# EasyEDA schematic SCH_Sensor circuit design_2023-04-27.json
TITLE: Sensor Board; REV: 1.0; Date: 2022-11-28; Sheet: 1/1; Drawn By: Jamie Warnock; Company: MEng Group Project
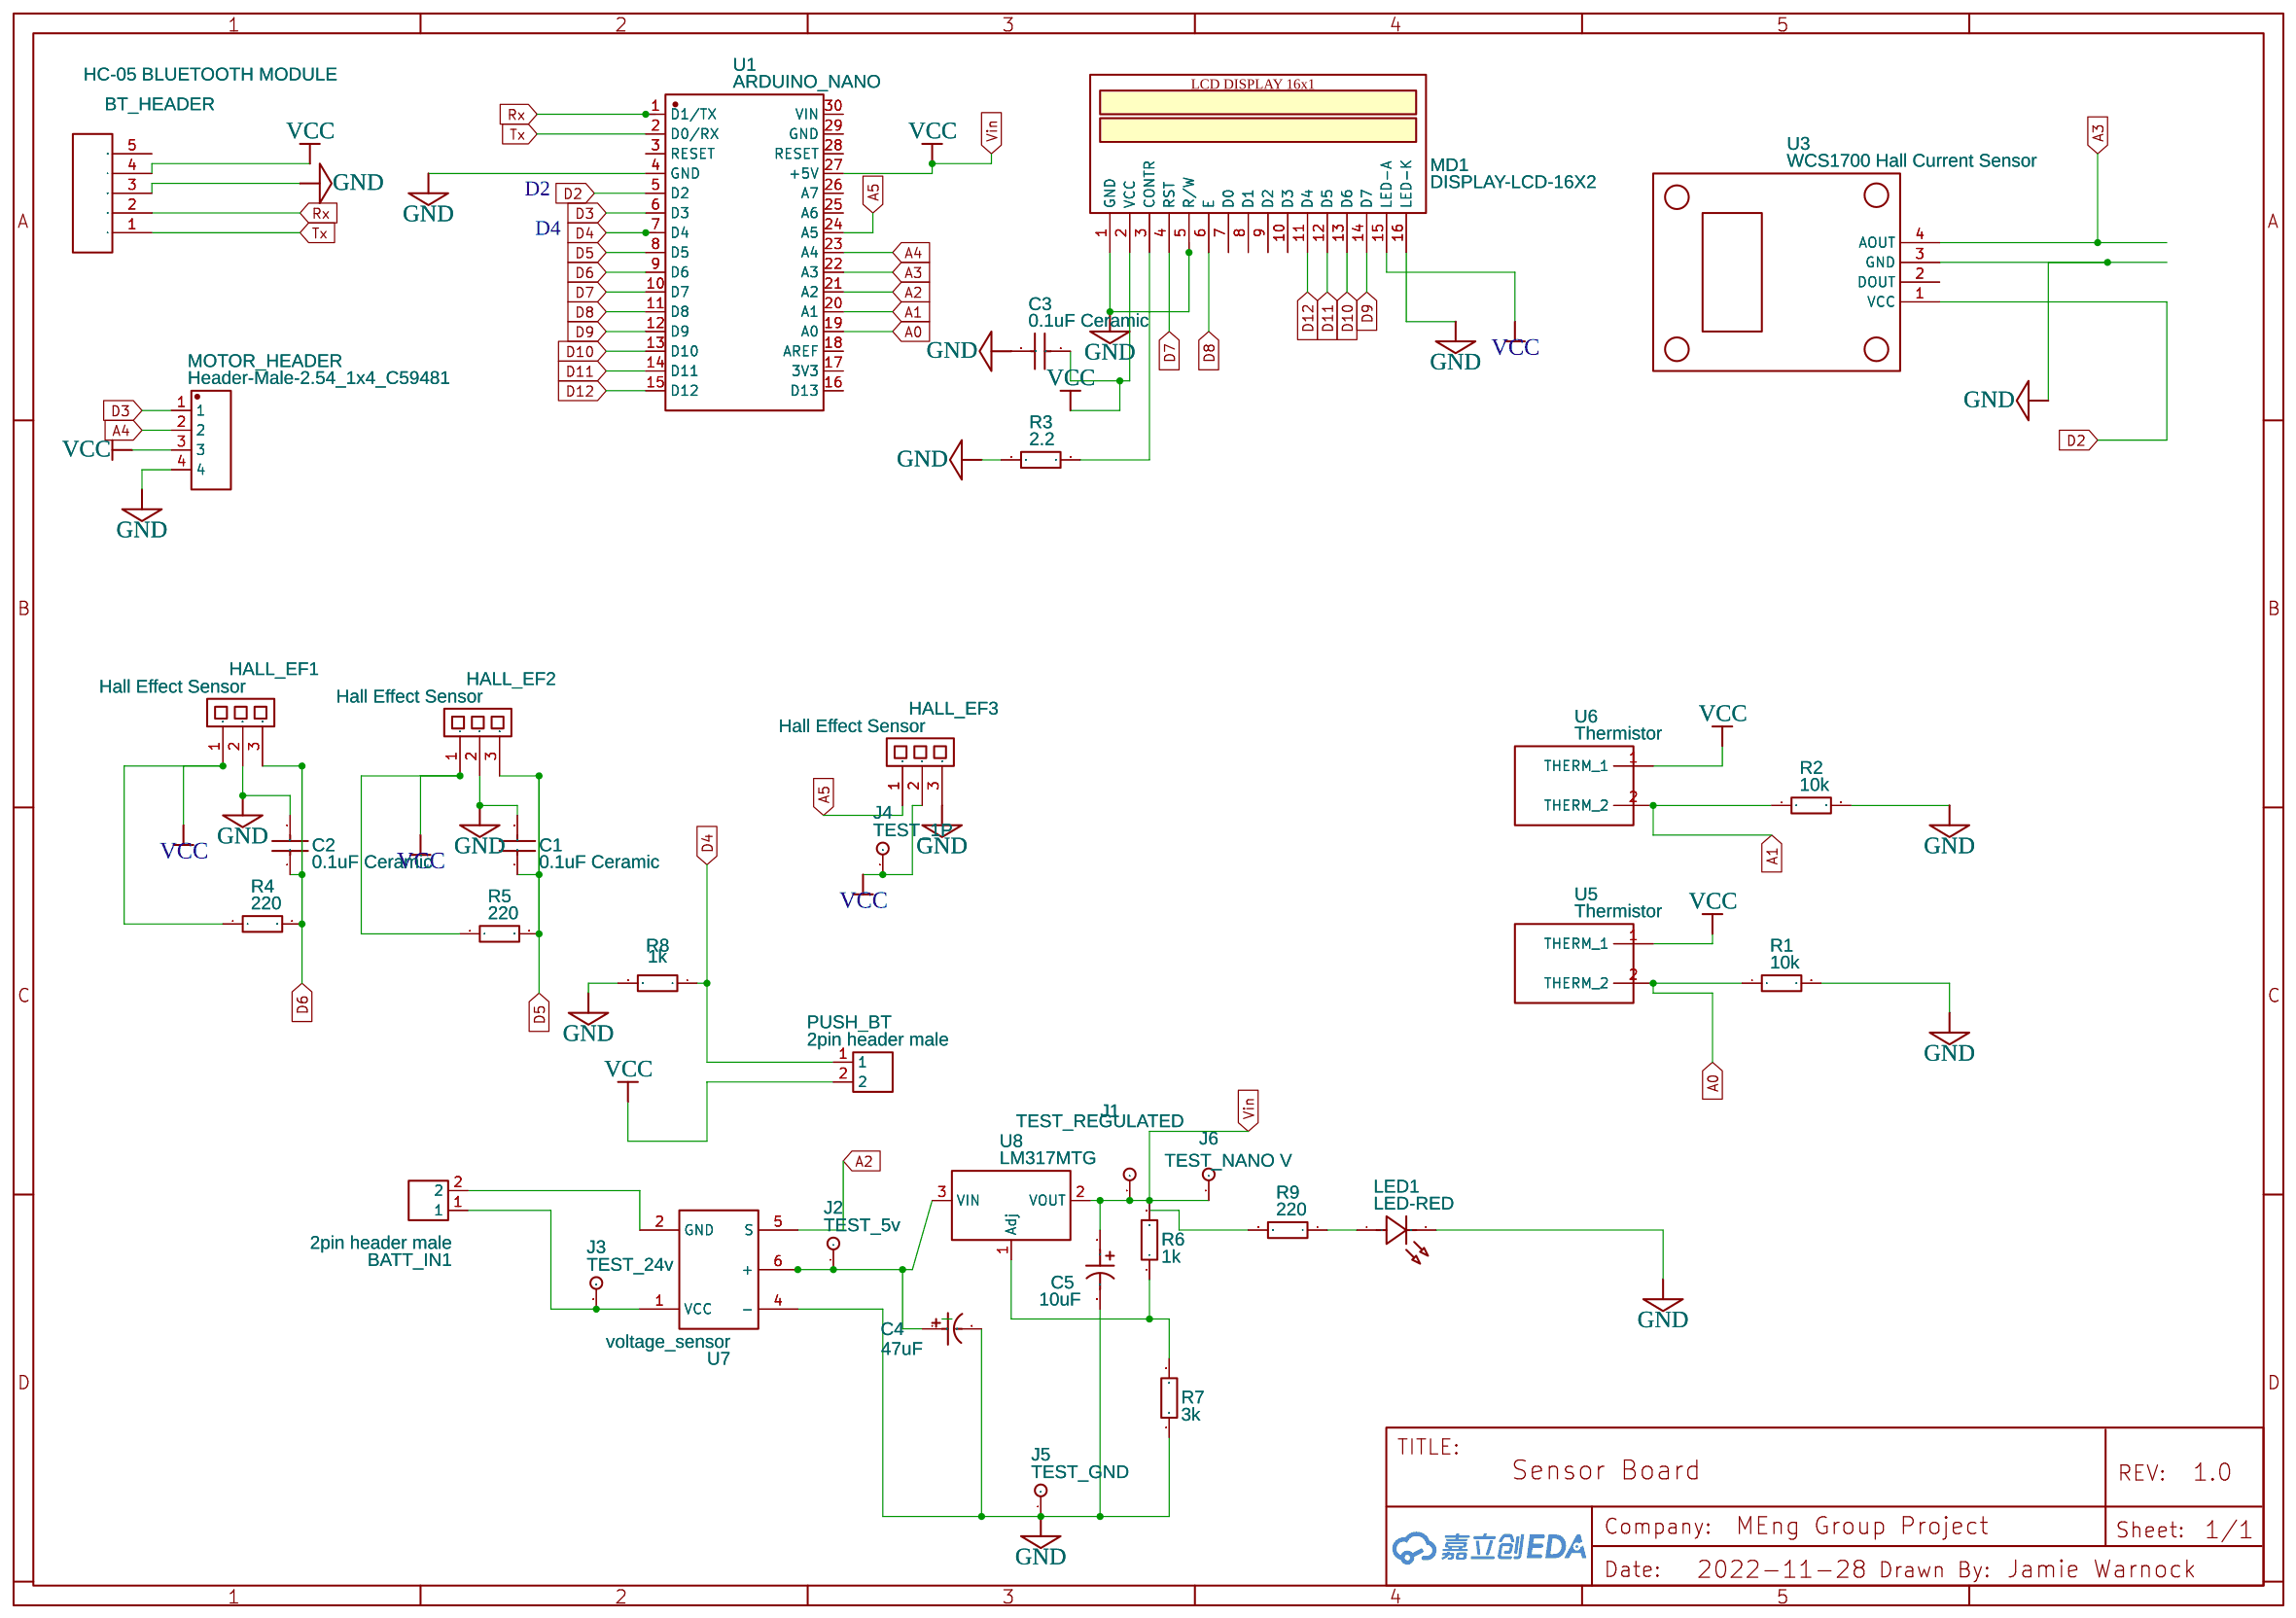
[diagram p0: schematic sheet]

## Parts
BATT_IN1  2pin header male  [CONN-TH_KF35R-8.25-2P]
BT_HEADER  HC-05 BLUETOOTH MODULE  [PIN_HEADER_FEMALE_5 PIN]
C1  0.1uF Ceramic  [CERAMIC CAPACITOR]
C2  0.1uF Ceramic  [CERAMIC CAPACITOR]
C3  0.1uF Ceramic  [CERAMIC CAPACITOR]
C4  47uF  [V 47UF 100V]
C5  10uF  [CAP-TH_BD5.0-P2.00-D0.5-FD-1]
HALL_EF1  Hall Effect Sensor  [HEADER MALE OR FEMALE PINS 1X3]
HALL_EF2  Hall Effect Sensor  [HEADER MALE OR FEMALE PINS 1X3]
HALL_EF3  Hall Effect Sensor  [HEADER MALE OR FEMALE PINS 1X3]
J1  TEST_REGULATED  [TESTPOINT-SMD_BD5.0]
J2  TEST_5v  [TESTPOINT-SMD_BD5.0]
J3  TEST_24v  [TESTPOINT-SMD_BD5.0]
J4  TEST_1P  [TESTPOINT-SMD_BD5.0]
J5  TEST_GND  [TESTPOINT-SMD_BD5.0]
J6  TEST_NANO V  [TESTPOINT-SMD_BD5.0]
LED1  LED-RED  [LED]
MD1  DISPLAY-LCD-16X2  [DISPLAY-LCD-16X2]
MOTOR_HEADER  Header-Male-2.54_1x4_C59481  [HDR-TH_4P-P2.54-V-M]
PUSH_BT  2pin header male  [2PIN MALE HEADER]
R1  10k  [RES-TH_BD5.5-L15.0-P19.00-D0.8]
R2  10k  [RES-TH_BD5.5-L15.0-P19.00-D0.8]
R3  2.2  [RES-TH_BD5.5-L15.0-P19.00-D0.8]
R4  220  [RES-TH_BD5.5-L15.0-P19.00-D0.8]
R5  220  [RES-TH_BD5.5-L15.0-P19.00-D0.8]
R6  1k  [RES-TH_BD5.5-L15.0-P19.00-D0.8]
R7  3k  [RES-TH_BD5.5-L15.0-P19.00-D0.8]
R8  1k  [RES-TH_BD5.5-L15.0-P19.00-D0.8]
R9  220  [RES-TH_BD5.5-L15.0-P19.00-D0.8]
U1  ARDUINO_NANO  [COMM-TH_ARDUINO_NANO]
U3  WCS1700 Hall Current Sensor  [SENSOR CORRIENTE DC 5VDC]
U5  Thermistor  [THERMISTOR-PCB]
U6  Thermistor  [THERMISTOR-PCB]
U7  voltage_sensor  [NMH2405SC]
U8  LM317MTG  [TO-220-3_L10.0-W4.5-P2.54-L]

## Library data of the parts
BATT_IN1 PUSH_BT = 2pin header male: Supplier: LCSC; Manufacturer Part: Headers  Pins2.54mm1*10P; Supplier Part: C57369; JLCPCB Part Class: Extended Part; Contributor: Omkar Pattanaik
BT_HEADER = Female pin header 5 3D: Manufacturer Part: New SchematicLib; Contributor: Sergei Gurinovits
C1-C3 = Capacitor_Ceramic: Contributor: jr_pilot
C4 = v 47uF 100V: Supplier: LCSC; Manufacturer: ValuePro; Manufacturer Part: 47uF 100V; Supplier Part: C36473; JLCPCB Part Class: Extended Part; Contributor: Vijith ECE
C5 = 50V10UF CD110_C2960373: Supplier: LCSC; Supplier Part: C2960373; Manufacturer: HRK(鸿瑞凯电子); Manufacturer Part: 50V10uF CD110; Contributor: lcsc
HALL_EF1-HALL_EF3 = HEADER MALE 1X3: Contributor: dardito2
J1-J6 = TEST_1P: Contributor: KiCAD; license: https://www.gnu.org/licenses/lgpl-2.1.html
LED1 = LED-RED: Supplier: LCSC; Supplier Part: C605466; Manufacturer: Everlight Elec; Manufacturer Part: 264-7ID; Contributor: JohnOniudra; JLCPCB Part Class: Extended Part
MD1 = DISPLAY-LCD-16X2: Contributor: edsonemboaba
MOTOR_HEADER = Header-Male-2.54_1x4_C59481: Supplier: LCSC; Manufacturer: ReliaPro; Manufacturer Part: Headers  Pins 1*4P; Supplier Part: C59481
R1 R2 R4-R9 = EWWR0003J15R0T9: Supplier: LCSC; Supplier Part: C348853; Manufacturer: ResistorToday; Contributor: LCSC; JLCPCB Part Class: Extended Part; Resistance: 15Ω
R3 = EWWR0003J2R20T9: Supplier: LCSC; Supplier Part: C348866; Manufacturer: ResistorToday; Contributor: LCSC; JLCPCB Part Class: Extended Part; Resistance: 2.2Ω
U1 = ARDUINO_NANO: Supplier: LCSC; Supplier Part: C9900017879; Manufacturer: null; JLCPCB Part Class: Extended Part; Contributor: lcsc
U3 = WCS1700 Hall Current Sensor: Manufacturer: AOWEZIIC; Supplier Part: WCS1700; Contributor: The shadow of me
U5 U6 = Thermistor: Contributor: xstaticgrey
U7 = voltage_sensor: Manufacturer: Murata Manufacturing Co., Ltd.; Manufacturer Part: NMH1212SC; Supplier Part: 811-1518-5-ND; Contributor: mimk0404120
U8 = LM317MTG: Supplier: LCSC; Supplier Part: C907009; Manufacturer: onsemi(安森美); Contributor: LCSC; JLCPCB Part Class: Extended Part

## Nets
GND: BT_HEADER.3 C1.2 C2.2 C3.1 C4.2 C5.2 HALL_EF1.2 HALL_EF2.2 HALL_EF3.3 J5.1 LED1.2(K) MD1.1(GND) MD1.5(R/W) MD1.16(LED-K) MOTOR_HEADER.4 R1.2 R2.2 R3.1 R7.1 R8.2 U1.4(GND) U3.3(GND) U7.4(-)
VCC: BT_HEADER.4 C3.2 C5.1 HALL_EF1.1 HALL_EF2.1 HALL_EF3.2 J1.1 J4.1 J6.1 MD1.2(VCC) MD1.15(LED-A) MOTOR_HEADER.3 PUSH_BT.2 R4.1 R5.1 R6.2 R9.2 U1.27(+5V) U5.1(THERM 1) U6.1(THERM 1) U8.2(VOUT)
A0: R1.1 U1.19(A0) U5.2(THERM 2)
A1: R2.1 U1.20(A1) U6.2(THERM 2)
A2: U1.21(A2) U7.5(S)
A3: U1.22(A3) U3.4(AOUT)
A4: MOTOR_HEADER.2 U1.23(A4)
A5: HALL_EF3.1 U1.24(A5)
D2: U1.5(D2) U3.1(VCC)
D3: MOTOR_HEADER.1 U1.6(D3)
D4: PUSH_BT.1 R8.1 U1.7(D4)
D5: C1.1 HALL_EF2.3 R5.2 U1.8(D5)
D6: C2.1 HALL_EF1.3 R4.2 U1.9(D6)
D7: MD1.4(RST) U1.10(D7)
D8: MD1.6(E) U1.11(D8)
D9: MD1.14(D7) U1.12(D9)
D10: MD1.13(D6) U1.13(D10)
D11: MD1.12(D5) U1.14(D11)
D12: MD1.11(D4) U1.15(D12)
Rx: BT_HEADER.2 U1.1(D1/TX)
Tx: BT_HEADER.1 U1.2(D0/RX)
Net-(BATT_IN1-1): BATT_IN1.1 J3.1 U7.1(VCC)
Net-(BATT_IN1-2): BATT_IN1.2 U7.2(GND)
Net-(C4-1): C4.1 J2.1 U7.6(+) U8.3(VIN)
Net-(LED1-1): LED1.1(A) R9.1
Net-(MD1-3): MD1.3(CONTR) R3.2
Net-(R6-1): R6.1 R7.2 U8.1(Adj)

Not connected (* = marked no-connect by the designer): BT_HEADER 5; MD1 7(D0) 8(D1) 9(D2) 10(D3); U1 3(RESET) 16(D13) 17(3V3) 18(AREF) 25(A6) 26(A7) 28(RESET) 29(GND) 30(VIN); U3 2(DOUT)

## Notes on the sheet
- D2
- D4
